# EAGLE schematic controls (EAGLE 6.5.0)
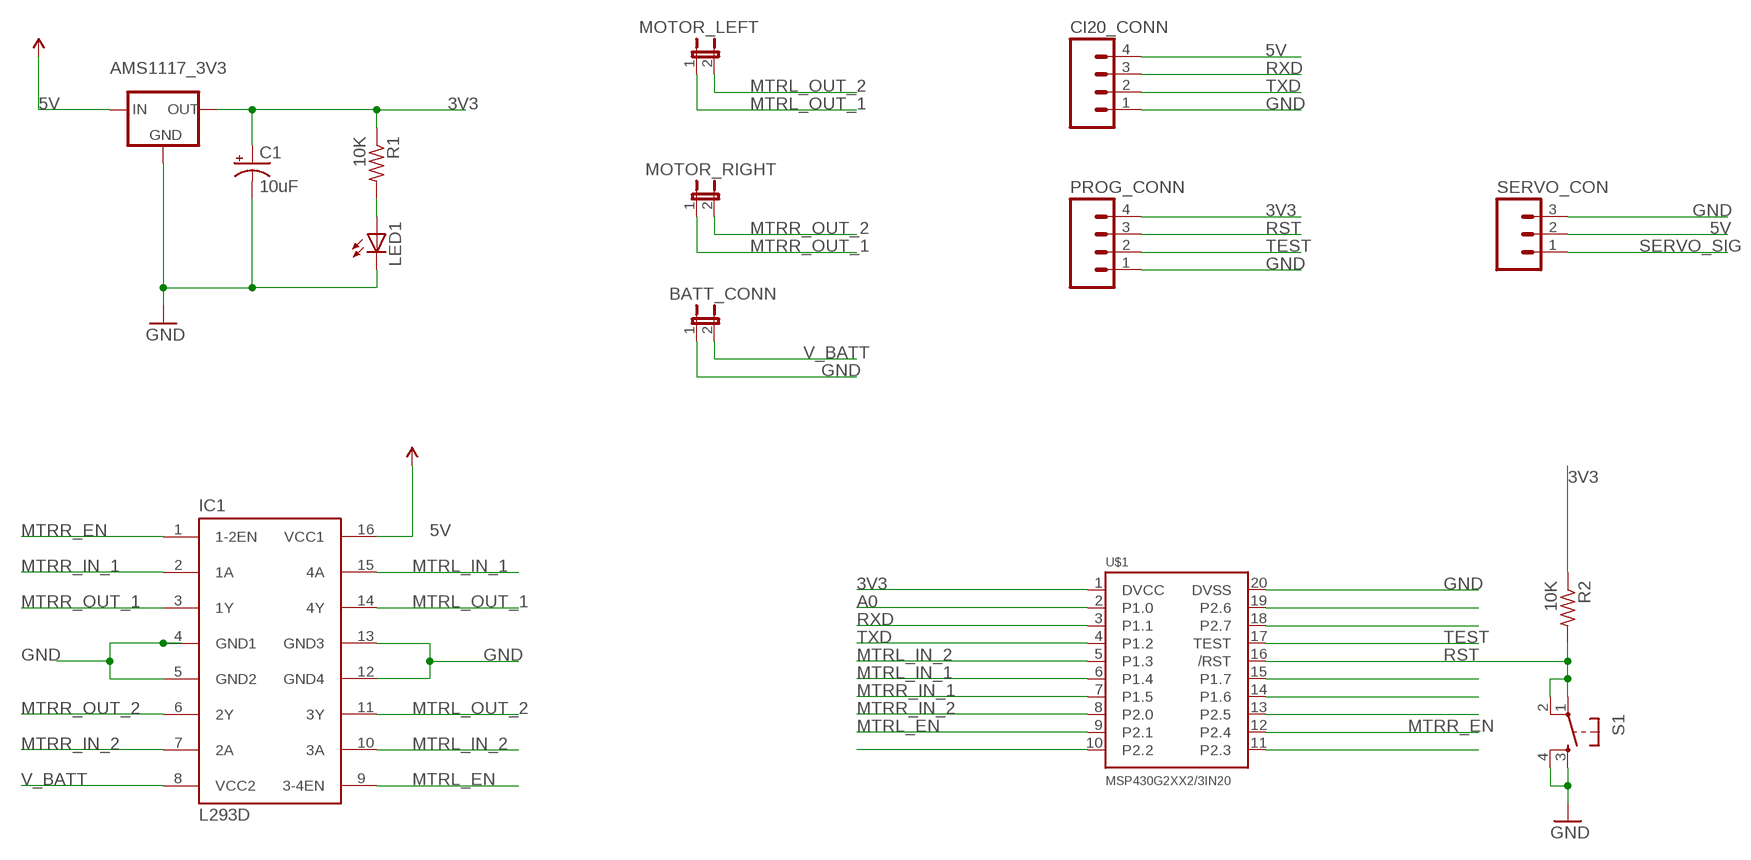
[diagram p0: schematic, sheet 1]

## Parts
AMS1117_3V3  V_REG_LD1117VXX  [78XXL]
BATT_CONN  JUMPER-2PTH  [1X02]
C1  10uF  CPOL-USE2.5-6  [E2,5-6]
CI20_CONN  M04PTH  [1X04]
IC1  L293D  [DIL16]
LED1  LED5MM  [LED5MM]
MOTOR_LEFT  JUMPER-2PTH  [1X02]
MOTOR_RIGHT  JUMPER-2PTH  [1X02]
PROG_CONN  M04PTH  [1X04]
R1  10K  R-US_0207/12  [0207/12]
R2  10K  R-US_0207/12  [0207/12]
S1  TAC_SWITCHPTH  [TACTILE-PTH]
SERVO_CON  M03PTH  [1X03]
U$1  MSP430G2XX2/3IN20  [DIL20]

## Nets
3V3: AMS1117_3V3.GND(OUT) C1.+ PROG_CONN.4 R1.1 R2.1 U$1.1(DVCC)
5V: AMS1117_3V3.OUT(IN) CI20_CONN.4 IC1.16(VCC1) SERVO_CON.2 ; supply symbol labelled VCC
A0: U$1.2(P1.0)
GND: AMS1117_3V3.IN(GND) BATT_CONN.1 C1.- CI20_CONN.1 IC1.4(GND1) IC1.5(GND2) IC1.12(GND4) IC1.13(GND3) LED1.K(C) PROG_CONN.1 S1.3 S1.4 SERVO_CON.3 U$1.20(DVSS)
MTRL_EN: IC1.9(3-4EN) U$1.9(P2.1)
MTRL_IN_1: IC1.15(4A) U$1.6(P1.4)
MTRL_IN_2: IC1.10(3A) U$1.5(P1.3)
MTRL_OUT_1: IC1.14(4Y) MOTOR_LEFT.1
MTRL_OUT_2: IC1.11(3Y) MOTOR_LEFT.2
MTRR_EN: IC1.1(1-2EN) U$1.12(P2.4)
MTRR_IN_1: IC1.2(1A) U$1.7(P1.5)
MTRR_IN_2: IC1.7(2A) U$1.8(P2.0)
MTRR_OUT_1: IC1.3(1Y) MOTOR_RIGHT.1
MTRR_OUT_2: IC1.6(2Y) MOTOR_RIGHT.2
N$2: LED1.A R1.2
N$3: U$1.19(P2.6)
N$4: U$1.18(P2.7)
N$10: U$1.10(P2.2)
N$13: U$1.15(P1.7)
N$14: U$1.14(P1.6)
N$15: U$1.13(P2.5)
N$17: U$1.11(P2.3)
RST: PROG_CONN.3 R2.2 S1.1 S1.2 U$1.16(/RST)
RXD: CI20_CONN.3 U$1.3(P1.1)
SERVO_SIG: SERVO_CON.1
TEST: PROG_CONN.2 U$1.17(TEST)
TXD: CI20_CONN.2 U$1.4(P1.2)
V_BATT: BATT_CONN.2 IC1.8(VCC2)

## Library data of the parts
AMS1117_3V3 = SparkFun-PowerIC:V_REG_LD1117VXX: LD1117VXX voltage regulator. We carry the 3.3V version (COM-00526) in TO-220 package.
BATT_CONN MOTOR_LEFT MOTOR_RIGHT = SparkFun-Retired:JUMPER-2: Jumper Basic 0.1" spaced jumper. Use with breakaway headers.
C1 = rcl:CPOL-US: POLARIZED CAPACITOR, American symbol
CI20_CONN PROG_CONN = SparkFun-Connectors:M04: Header 4 Standard 4-pin 0.1" header. Use with straight break away headers (SKU : PRT-00116), right angle break away headers (PRT-00553), swiss pins (PRT-00743), machine pins (PRT-00117), and female headers (PRT-00115). Molex polarized connector foot print use with SKU : PRT-08231 with associated crimp pins and housings. 1MM SMD Version SKU: PRT-10208
IC1 = st-microelectronics:L293D: PUSH-PULL 4 CHANNEL DRIVER; MPN: L293D; OC_FARNELL: 9589619; OC_NEWARK: 56P8249
LED1 = led:LED: LED OSRAM: - CHIPLED LG R971, LG N971, LY N971, LG Q971, LY Q971, LO R971, LY R971 LH N974, LH R974 LS Q976, LO Q976, LY Q976 LO Q996 - Hyper CHIPLED LW Q18S LB Q993, LB Q99A, LB R99A - SideLED LS A670, LO A670, LY A670, LG A670, LP A670 LB A673, LV A673, LT A673, LW A673 LH A674 LY A675 LS A676, LA A676, LO A676, LY A676, LW A676 LS A679, LY A679, LG A679 - Hyper Micro SIDELED® LS Y876, LA Y876, LO Y876, LY Y876 LT Y87S - SmartLED LW L88C, LW L88S LB L89C, LB L89S, LG L890 LS L89K, LO L89K, LY L89K LS L896, LA L896, LO L896, LY L896 - TOPLED LS T670, LO T670, LY T670, LG T670, LP T670 LSG T670, LSP T670, LSY T670, LOP T670, LYG T670 LG T671, LOG T671, LSG T671 LB T673, LV T673, LT T673, LW T673 LH T674 LS T676, LA T676, LO T676, LY T676, LB T676, LH T676, LSB T676, LW T676 LB T67C, LV T67C, LT T67C, LS T67K, LO T67K, LY T67K, LW E67C LS E67B, LA E67B, LO E67B, LY E67B, LB E67C, LV E67C, LT E67C LW T67C LS T679, LY T679, LG T679 LS T770, LO T770, LY T770, LG T770, LP T770 LB T773, LV T773, LT T773, LW T773 LH T774 LS E675, LA E675, LY E675, LS T675 LS T776, LA T776, LO T776, LY T776, LB T776 LHGB T686 LT T68C, LB T68C - Hyper Mini TOPLED® LB M676 - Mini TOPLED Santana® LG M470 LS M47K, LO M47K, LY M47K Source: http://www.osram.convergy.de LUXEON: - LUMILED® LXK2-PW12-R00, LXK2-PW12-S00, LXK2-PW14-U00, LXK2-PW14-V00 LXK2-PM12-R00, LXK2-PM12-S00, LXK2-PM14-U00 LXK2-PE12-Q00, LXK2-PE12-R00, LXK2-PE12-S00, LXK2-PE14-T00, LXK2-PE14-U00 LXK2-PB12-K00, LXK2-PB12-L00, LXK2-PB12-M00, LXK2-PB14-N00, LXK2-PB14-P00, LXK2-PB14-Q00 LXK2-PR12-L00, LXK2-PR12-M00, LXK2-PR14-Q00, LXK2-PR14-R00 LXK2-PD12-Q00, LXK2-PD12-R00, LXK2-PD12-S00 LXK2-PH12-R00, LXK2-PH12-S00 LXK2-PL12-P00, LXK2-PL12-Q00, LXK2-PL12-R00 Source: www.luxeon.com KINGBRIGHT: KA-3528ASYC Source: www.kingbright.com
R1 R2 = rcl:R-US_: RESISTOR, American symbol
S1 = SparkFun-Retired:TAC_SWITCH: Momentary Switch Button commonly used for reset or general input. Spark Fun Electronics SKU : COM-00097 SMT- SWCH-08247
SERVO_CON = SparkFun-Connectors:M03: Header 3 Standard 3-pin 0.1" header. Use with straight break away headers (SKU : PRT-00116), right angle break away headers (PRT-00553), swiss pins (PRT-00743), machine pins (PRT-00117), and female headers (PRT-00115). Molex polarized connector foot print use with SKU : PRT-08232 with associated crimp pins and housings.
U$1 = ti_msp430gxxx:MSP430G2XX2/3: Mixed Signal Microcontroller MSP430 Value Line MSP430G2432: 1x EEM, 8 KiB Flash Memory, 256 B RAM, 1x Timer_A, 1x USI, 8x ADC10 Ch, 16x I/O MSP430G2332: 1x EEM, 4 KiB Flash Memory, 256 B RAM, 1x Timer_A, 1x USI, 8x ADC10 Ch, 16x I/O MSP430G2232: 1x EEM, 2 KiB Flash Memory, 256 B RAM, 1x Timer_A, 1x USI, 8x ADC10 Ch, 16x I/O MSP430G2132: 1x EEM, 1 KiB Flash Memory, 128 B RAM, 1x Timer_A, 1x USI, 8x ADC10 Ch, 16x I/O MSP430G2402: 1x EEM, 8 KiB Flash Memory, 256 B RAM, 1x Timer_A, 1x USI, 16x I/O MSP430G2302: 1x EEM, 4 KiB Flash Memory, 256 B RAM, 1x Timer_A, 1x USI, 16x I/O MSP430G2202: 1x EEM, 2 KiB Flash Memory, 256 B RAM, 1x Timer_A, 1x USI, 16x I/O MSP430G2102: 1x EEM, 1 KiB Flash Memory, 128 B RAM, 1x Timer_A, 1x USI, 16x I/O MSP430G2452: 1x EEM, 8 KiB Flash Memory, 256 B RAM, 1x Timer_A, 8x Comp_A Ch, 1x USI, 8x ADC10 Ch, 16x I/O MSP430G2352: 1x EEM, 4 KiB Flash Memory, 256 B RAM, 1x Timer_A, 8x Comp_A Ch, 1x USI, 8x ADC10 Ch, 16x I/O MSP430G2252: 1x EEM, 2 KiB Flash Memory, 256 B RAM, 1x Timer_A, 8x Comp_A Ch, 1x USI, 8x ADC10 Ch, 16x I/O MSP430G2152: 1x EEM, 1 KiB Flash Memory, 128 B RAM, 1x Timer_A, 8x Comp_A Ch, 1x USI, 8x ADC10 Ch, 16x I/O MSP430G2412: 1x EEM, 8 KiB Flash Memory, 256 B RAM, 1x Timer_A, 8x Comp_A Ch, 1x USI, 16x I/O MSP430G2312: 1x EEM, 4 KiB Flash Memory, 256 B RAM, 1x Timer_A, 8x Comp_A Ch, 1x USI, 16x I/O MSP430G2212: 1x EEM, 2 KiB Flash Memory, 256 B RAM, 1x Timer_A, 8x Comp_A Ch, 1x USI, 16x I/O MSP430G2112: 1x EEM, 1 KiB Flash Memory, 128 B RAM, 1x Timer_A, 8x Comp_A Ch, 1x USI, 16x I/O MSP430G2533: 1x BSL, 1x EEM, 16 KiB Flash Memory, 512 B RAM, 2x Timer_A, 8x ADC10 Ch, 1x USCI A0/B0, 16x I/O MSP430G2433: 1x BSL, 1x EEM, 8 KiB Flash Memory, 512 B RAM, 2x Timer_A, 8x ADC10 Ch, 1x USCI A0/B0, 16x I/O MSP430G2333: 1x BSL, 1x EEM, 4 KiB Flash Memory, 256 B RAM, 2x Timer_A, 8x ADC10 Ch, 1x USCI A0/B0, 16x I/O MSP430G2233: 1x BSL, 1x EEM, 2 KiB Flash Memory, 256 B RAM, 2x Timer_A, 8x ADC10 Ch, 1x USCI A0/B0, 16x I/O MSP430G2403: 1x BSL, 1x EEM, 8 KiB Flash Memory, 512 B RAM, 2x Timer_A, 1x USCI A0/B0, 16x I/O MSP430G2303: 1x BSL, 1x EEM, 4 KiB Flash Memory, 256 B RAM, 2x Timer_A, 1x USCI A0/B0, 16x I/O MSP430G2203: 1x BSL, 1x EEM, 2 KiB Flash Memory, 256 B RAM, 2x Timer_A, 1x USCI A0/B0, 16x I/O MSP430G2553: 1x BSL, 1x EEM, 16 KiB Flash Memory, 512 B RAM, 2x Timer_A, 8x Comp_A+ Ch, 8x ADC10 Ch, 1x USCI A0/B0, 16x I/O MSP430G2453: 1x BSL, 1x EEM, 8 KiB Flash Memory, 512 B RAM, 2x Timer_A, 8x Comp_A+ Ch, 8x ADC10 Ch, 1x USCI A0/B0, 16x I/O MSP430G2353: 1x BSL, 1x EEM, 4 KiB Flash Memory, 256 B RAM, 2x Timer_A, 8x Comp_A+ Ch, 8x ADC10 Ch, 1x USCI A0/B0, 16x I/O MSP430G2253: 1x BSL, 1x EEM, 2 KiB Flash Memory, 256 B RAM, 2x Timer_A, 8x Comp_A+ Ch, 8x ADC10 Ch, 1x USCI A0/B0, 16x I/O MSP430G2153: 1x BSL, 1x EEM, 1 KiB Flash Memory, 256 B RAM, 2x Timer_A, 8x Comp_A+ Ch, 8x ADC10 Ch, 1x USCI A0/B0, 16x I/O MSP430G2513: 1x BSL, 1x EEM, 16 KiB Flash Memory, 512 B RAM, 2x Timer_A, 8x Comp_A+ Ch, 1x USCI A0/B0, 16x I/O MSP430G2413: 1x BSL, 1x EEM, 8 KiB Flash Memory, 512 B RAM, 2x Timer_A, 8x Comp_A+ Ch, 1x USCI A0/B0, 16x I/O MSP430G2313: 1x BSL, 1x EEM, 4 KiB Flash Memory, 256 B RAM, 2x Timer_A, 8x Comp_A+ Ch, 1x USCI A0/B0, 16x I/O MSP430G2213: 1x BSL, 1x EEM, 2 KiB Flash Memory, 256 B RAM, 2x Timer_A, 8x Comp_A+ Ch, 1x USCI A0/B0, 16x I/O MSP430G2113: 1x BSL, 1x EEM, 1 KiB Flash Memory, 256 B RAM, 2x Timer_A, 8x Comp_A+ Ch, 1x USCI A0/B0, 16x I/O